# Altium schematic sheet LCD.SchDoc
size 381 x 241 mm; SheetNumber: 5; SheetTotal: 6
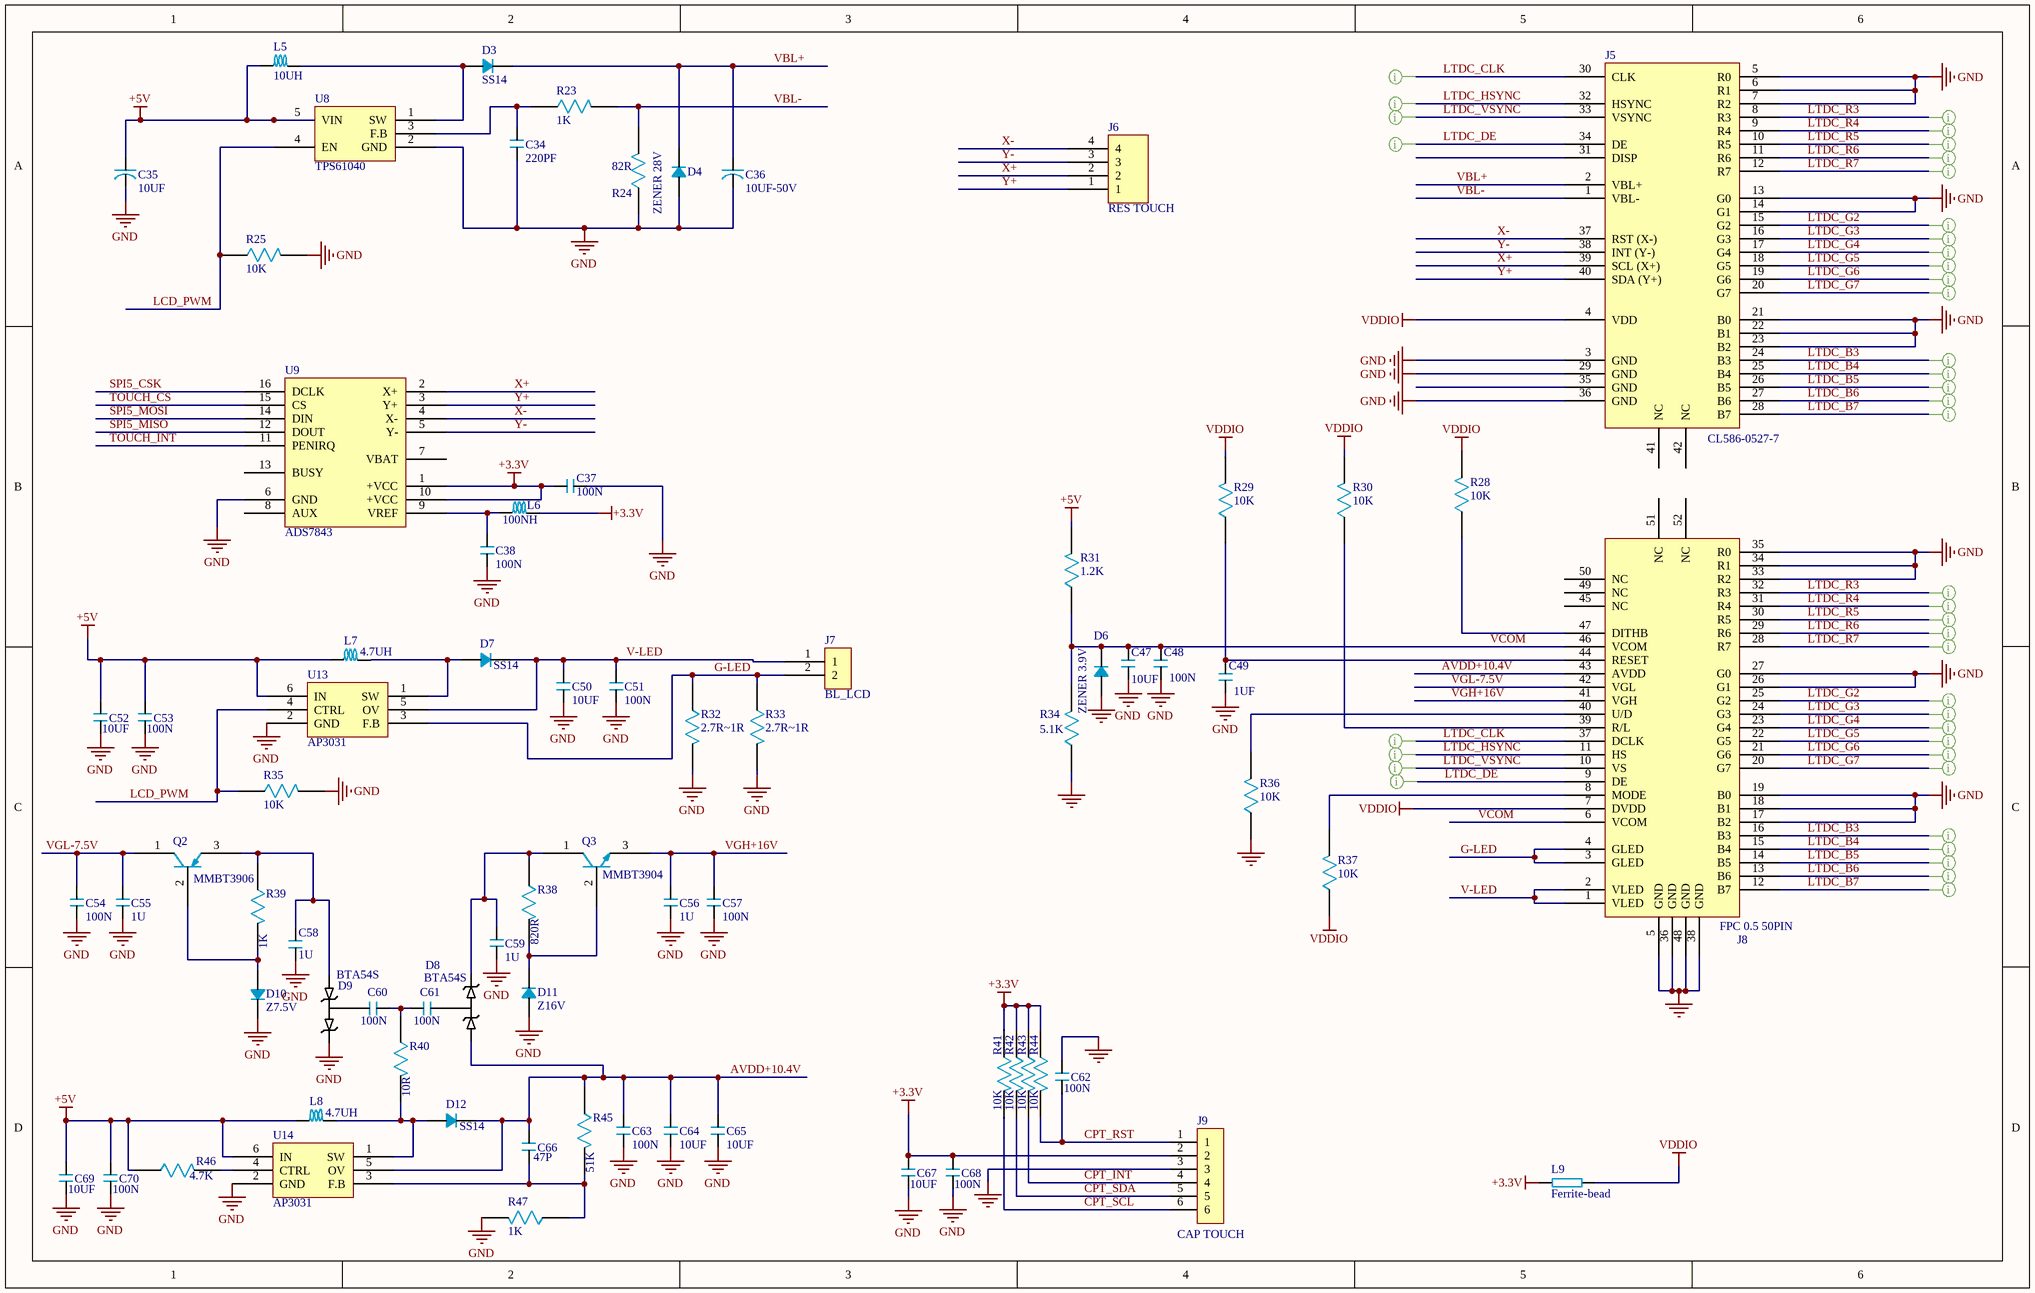
[diagram p0: LCD.SchDoc]

## Parts
C34  220PF  [1206]
C35  10UF  [1206]
C36  10UF-50V  [RB.1/.3]
C37  100N  [0603]
C38  100N  [0603]
C47  10UF  [0603]
C48  100N  [0603]
C49  1UF  [0603]
C50  10UF  [0603]
C51  100N  [0603]
C52  10UF  [0603]
C53  100N  [0603]
C54  100N  [0603]
C55  1U  [0603]
C56  1U  [0603]
C57  100N  [0603]
C58  1U  [0603]
C59  1U  [0603]
C60  100N  [0603]
C61  100N  [0603]
C62  100N  [0603]
C63  100N  [0603]
C64  10UF  [0603]
C65  10UF  [0603]
C66  47P  [0603]
C67  10UF  [0603]
C68  100N  [0603]
C69  10UF  [0603]
C70  100N  [0603]
D3  SS14  [SOD-123-B]
D4  ZENER 28V  [SOD-123]
D6  ZENER 3.9V  [SOD-123]
D7  SS14  [SOD-123-B]
D8  BTA54S  [SOT-23]
D9  BTA54S  [SOT-23]
D10  Z7.5V  [MINI-MELF]
D11  Z16V  [MINI-MELF]
D12  SS14  [SOD-123-B]
J5  CL586-0527-7  [PFC-40]
J6  RES TOUCH  [4PIN-1.5MM-SMD]
J7  BL_LCD  [BL_LCD]
J8  FPC 0.5 50PIN  [PFC-50]
J9  CAP TOUCH  [FPC-6-TOP-1MM]
L5  10UH  [SELF_7MM]
L6  100NH  [1206]
L7  4.7UH  [SELF_7MM]
L8  4.7UH  [SELF_7MM]
L9  Ferrite-bead  [0805]
Q2  MMBT3906  [BC337]
Q3  MMBT3904  [BC337]
R23  1K  [1206]
R24  82R  [1206]
R25  10K  [1206]
R28  10K  [0603]
R29  10K  [0603]
R30  10K  [0603]
R31  1.2K  [0603]
R32  2.7R~1R  [0603]
R33  2.7R~1R  [0603]
R34  5.1K  [0603]
R35  10K  [0603]
R36  10K  [0603]
R37  10K  [0603]
R38  820R  [0603]
R39  1K  [0603]
R40  10R  [0603]
R41  10K  [0603]
R42  10K  [0603]
R43  10K  [0603]
R44  10K  [0603]
R45  51K  [0603]
R46  4.7K  [0603]
R47  1K  [0603]
U8  TPS61040  [SOT23-5]
U9  ADS7843  [TSSOP-16]
U13  AP3031  [SOT23-6]
U14  AP3031  [SOT23-6]

## Nets
+3.3V: C37.2 C67.1 C68.1 J9.2 L6.2 L9.1 R41.1 R42.1 R43.1 R44.1 U9.1(+VCC) U9.10(+VCC)
+5V: C35.1 C52.1 C53.1 C69.1 C70.1 L5.1 L7.1 L8.1 R31.2 R46.1 U8.5(VIN) U13.6(IN) U14.6(IN)
GND: C34.1 C35.2 C36.2 C37.1 C38.1 C47.2 C48.2 C49.2 C50.2 C51.2 C52.2 C53.2 C54.2 C55.2 C56.2 C57.2 C58.2 C59.2 C62.1 C63.2 C64.2 C65.2 C67.2 C68.2 C69.2 C70.2 D4.1 D6.1 D9.2 D10.2 D11.1 J5.3(GND) J5.5(R0) J5.6(R1) J5.7(R2) J5.13(G0) J5.14(G1) J5.21(B0) J5.22(B1) J5.23(B2) J5.29(GND) J5.36(GND) J8.5(GND) J8.17(B2) J8.18(B1) J8.19(B0) J8.26(G1) J8.27(G0) J8.33(R2) J8.34(R1) J8.35(R0) J8.36(GND) J8.38(GND) J8.48(GND) J9.3 R24.1 R25.2 R32.2 R33.2 R34.1 R35.2 R36.1 R47.2 U8.2(GND) U9.6(GND) U13.2(GND) U14.2(GND)
VDDIO: J5.4(VDD) J8.7(DVDD) L9.2 R28.2 R29.2 R30.2 R37.1
AVDD+10.4V: C63.1 C64.1 C65.1 C66.1 D8.1 D12.2 J8.43(AVDD) R45.1 U14.5(OV)
CPT_INT: J9.4 R43.2
CPT_RST: C62.2 J9.1 R44.2
CPT_SCL: J9.6 R41.2
CPT_SDA: J9.5 R42.2
G-LED: J7.2 J8.3(GLED) J8.4(GLED) R32.1 R33.1 U13.3(F.B)
LCD_PWM: R25.1 R35.1 U8.4(EN) U13.4(CTRL)
LTDC_B3: J5.24(B3) J8.16(B3)
LTDC_B4: J5.25(B4) J8.15(B4)
LTDC_B5: J5.26(B5) J8.14(B5)
LTDC_B6: J5.27(B6) J8.13(B6)
LTDC_B7: J5.28(B7) J8.12(B7)
LTDC_CLK: J5.30(CLK) J8.37(DCLK)
LTDC_DE: J5.34(DE) J8.9(DE)
LTDC_G2: J5.15(G2) J8.25(G2)
LTDC_G3: J5.16(G3) J8.24(G3)
LTDC_G4: J5.17(G4) J8.23(G4)
LTDC_G5: J5.18(G5) J8.22(G5)
LTDC_G6: J5.19(G6) J8.21(G6)
LTDC_G7: J5.20(G7) J8.20(G7)
LTDC_HSYNC: J5.32(HSYNC) J8.11(HS)
LTDC_R3: J5.8(R3) J8.32(R3)
LTDC_R4: J5.9(R4) J8.31(R4)
LTDC_R5: J5.10(R5) J8.30(R5)
LTDC_R6: J5.11(R6) J8.29(R6)
LTDC_R7: J5.12(R7) J8.28(R7)
LTDC_VSYNC: J5.33(VSYNC) J8.10(VS)
SPI5_CSK: U9.16(DCLK)
SPI5_MISO: U9.12(DOUT)
SPI5_MOSI: U9.14(DIN)
TOUCH_CS: U9.15(CS)
TOUCH_INT: U9.11(PENIRQ)
V-LED: C50.1 C51.1 D7.2 J7.1 J8.1(VLED) J8.2(VLED) U13.5(OV)
VBL+: C36.1 D3.2 D4.2 J5.2(VBL+)
VBL-: J5.1(VBL-) R23.2 R24.2
VCOM: C47.1 C48.1 D6.2 J8.6(VCOM) J8.46(VCOM) R31.1 R34.2
VGH+16V: C56.1 C57.1 J8.41(VGH) Q3.3
VGL-7.5V: C54.1 C55.1 J8.42(VGL) Q2.1
X+: J5.39(SCL_(X+)) J6.2 U9.2(X+)
X-: J5.37(RST_(X-)) J6.4 U9.4(X-)
Y+: J5.40(SDA_(Y+)) J6.1 U9.3(Y+)
Y-: J5.38(INT_(Y-)) J6.3 U9.5(Y-)
NetC34_2: C34.2 R23.1 U8.3(F.B)
NetC38_2: C38.2 L6.1 U9.9(VREF)
NetC49_1: C49.1 J8.44(RESET) R29.1
NetC58_1: C58.1 D9.1 Q2.3 R39.1
NetC59_1: C59.1 D8.2 Q3.1 R38.1
NetC60_1: C60.1 D9.3
NetC60_2: C60.2 C61.1 R40.1
NetC61_2: C61.2 D8.3
NetC66_2: C66.2 R45.2 R47.1 U14.3(F.B)
NetD3_1: D3.1 L5.2 U8.1(SW)
NetD7_1: D7.1 L7.2 U13.1(SW)
NetD10_1: D10.1 Q2.2 R39.2
NetD11_2: D11.2 Q3.2 R38.2
NetD12_1: D12.1 L8.2 R40.2 U14.1(SW)
NetJ8_8: J8.8(MODE) R37.2
NetJ8_39: J8.39(R/L) R30.1
NetJ8_40: J8.40(U/D) R36.2
NetJ8_47: J8.47(DITHB) R28.1
NetR46_2: R46.2 U14.4(CTRL)

Not connected (* = marked no-connect by the designer): J5 31(DISP) 35(GND) 41(NC) 42(NC); J8 45(NC) 49(NC) 50(NC) 51(NC) 52(NC); U9 7(VBAT) 8(AUX) 13(BUSY)

## Layout directives
net class LTDC: LTDC_B3, LTDC_B4, LTDC_B5, LTDC_B6, LTDC_B7, LTDC_CLK, LTDC_DE, LTDC_G2, LTDC_G3, LTDC_G4, LTDC_G5, LTDC_G6, LTDC_G7, LTDC_HSYNC, LTDC_R3, LTDC_R4, LTDC_R5, LTDC_R6, LTDC_R7, LTDC_VSYNC

## Library data of the parts
C34 C37 C38 C47-C70 = CAP
C35 C36 = CAP_POL
D3 D4 D6 D7 D10-D12 = DIODE
J5 = FPC 0.5 40PIN
J6 = 4-PIN
J9 = FPC-6-TOP-1MM
L5-L8 = SELF
Q2 = PNP-SMD
Q3 = NPN-SMD
R23-R25 R28-R47 = RES